# Altium schematic sheet Power_Supply.SchDoc: Power Supply
size A; Author: Yifei Li; DocumentNumber: 1; SheetNumber: 1; SheetTotal: 6
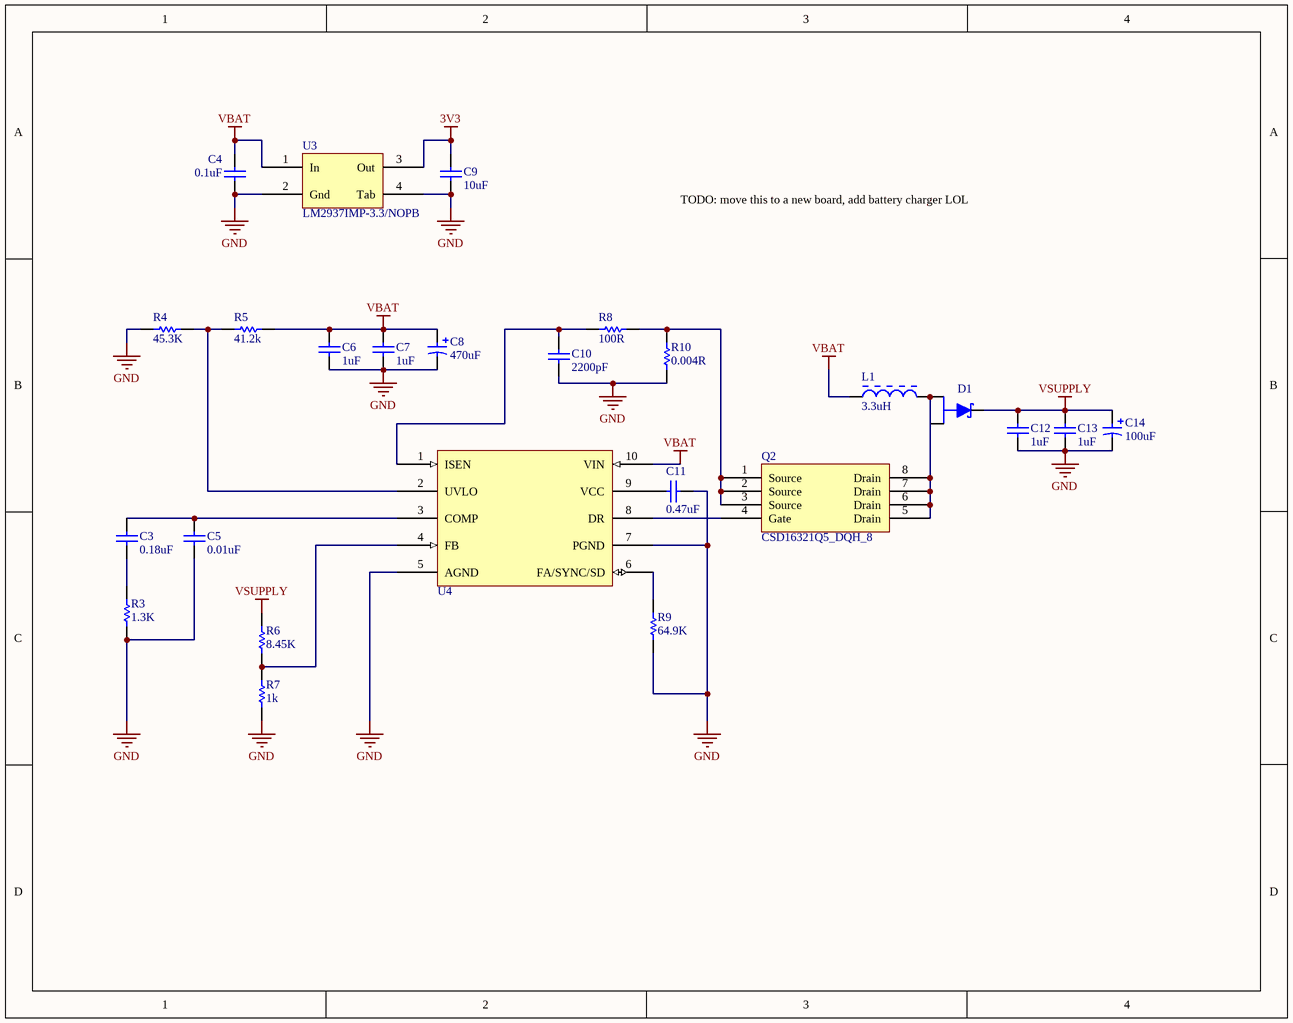
[diagram p0: Power_Supply.SchDoc]

## Parts
C3  0.18uF  [CAPC1608X09N]
C4  0.1uF  [CAPC1608X09N]
C5  0.01uF  [CAPC1608X09N]
C6  1uF  [CAPC1608X09N]
C7  1uF  [CAPC1608X09N]
C8  470uF  [NICHICON 8x10 CAP]
C9  10uF  [CAPC3216X18N]
C10  2200pF  [CAPC1608X09N]
C11  0.47uF  [CAPC1608X09N]
C12  1uF  [CAPC1608X09N]
C13  1uF  [CAPC1608X09N]
C14  100uF  [PCAP_8x10-ELEC00]
D1  (no value)  [ONSEMI DPAK-3]
L1  3.3uH  [IND_BOURNS_SRP00 - duplicate]
Q2  CSD16321Q5_DQH_8  [DQH8]
R3  1.3K  [RESC1608X06N]
R4  45.3K  [RESC1608X06N]
R5  41.2k  [RESC1608X06N]
R6  8.45K  [RESC1608X06N]
R7  1k  [RESC1608X06N]
R8  100R  [RESC1608X06N]
R9  64.9K  [RESC1608X06N]
R10  0.004R  [RESC6533X09N]
U3  LM2937IMP-3.3/NOPB  [DSO-G3/C6.4]
U4  LM3481  [VSSOP10]  (value not drawn)

## Nets
3V3: C9.2 U3.3(Out)
GND: C4.1 C5.1 C6.1 C7.1 C8.2 C9.1 C10.1 C11.2 C12.1 C13.1 C14.2 R3.1 R4.1 R7.1 R9.1 R10.1 U3.2(Gnd) U3.4(Tab) U4.5(AGND) U4.7(PGND)
VBAT: C4.2 C6.2 C7.2 C8.1 L1.1 R5.2 U3.1(In) U4.10(VIN)
VSUPPLY: C12.2 C13.2 C14.1 D1.4 R6.1
NetC3_1: C3.1 R3.2
NetC3_2: C3.2 C5.2 U4.3(COMP)
NetC10_2: C10.2 R8.1 U4.1(ISEN)
NetC11_1: C11.1 U4.9(VCC)
NetD1_1: D1.1 L1.2 Q2.5(Drain) Q2.6(Drain) Q2.7(Drain) Q2.8(Drain)
NetQ2_1: Q2.1(Source) Q2.2(Source) Q2.3(Source) R8.2 R10.2
NetQ2_4: Q2.4(Gate) U4.8(DR)
NetR4_2: R4.2 R5.1 U4.2(UVLO)
NetR6_2: R6.2 R7.2 U4.4(FB)
NetR9_2: R9.2 U4.6(FA/SYNC/SD)

Not connected (* = marked no-connect by the designer): D1 3

## Notes on the sheet
- TODO: move this to a new board, add battery charger LOL

## Library data of the parts
C3 = CAP CER 0.18uF 0603: Manufacturer: Murata; Voltage: 25V; Rating: X7R; Value: 0.18uF; Digikey Part Number: 490-6431-1-ND; Package: 0603
C4 = CAP CER 0.1uF 0603: Voltage: 100V; Rating: X7R; Tolerance: 10%; Value: 0.1uF; Digikey Part Number: 490-3285-1-ND; Package: 0603
C5 = CAP CER 0.01uF 0603: Manufacturer: Murata; Rating: C0G; Value: 0.01uF; Digikey Part Number: 490-9666-1-ND
C6 C7 C12 C13 = CAP CER 1uF 0603: Voltage: 35V; Value: 1uF; Digikey Part Number: 490-10487-1-ND
C8 = CAP ALUM 470uF SMD: Digikey Part Number: 493-2181-1-ND; Value: 470uF
C9 = CAP CER 10uF 1206: 3V3 filter cap; Voltage: 25V; Rating: X7R; Value: 10uF; Digikey Part Number: 490-6518-1-ND
C10 = CAP CER 2200pF 0603: Manufacturer: Murata; Voltage: 50V; Tolerance: 1%; Rating: C0G; Value: 2200pF; Digikey Part Number: 490-7768-1-ND
C11 = CAP CER 0.47uF 0603: Voltage: 25V; Rating: X7R; Value: 0.47uF; Digikey Part Number: 490-3291-1-ND
C14 = CAP ALUM 100uF SMD: Manufacturer: Nichicon; Voltage: 50V; Digikey Part Number: 493-2226-1-ND; Value: 100uF
D1 = MBRD835LT4G: SHOTTKEY 35V 8A; Type: SCHOT; Configuration: Single; Footprint: TO-252-3; Voltage: 35V; Current: 8A; Digikey Part Number: MBRD835LT4GOSCT-ND
L1 = IND 3.3µH 7A SMD: Digikey Part Number: SRP7030-3R3FMCT-ND; Value: 3.3uH
Q2 = CSD16321Q5_DQH_8: Manufacturer: Texas Instruments; INDUSTRY_STD_PKG_TYPE: SON; FAMILY_NAME: N-Channel MOSFET Transistors; PIN_COUNT: 8; PACKAGE_DESIGNATOR: DQH; Type: DEV; Datasheet URL: http://www.ti.com/lit/gpn/CSD16321Q5; GENERIC_PART_NUMBER: CSD16321Q5; RefDes: RefDes; Value: Value; Digikey Part Number: 296-25643-1-ND
R3 = RES 1.3K 0603: Manufacturer: Vishay Dale; Tolerance: 1%; Power: 0.1W; Type: RES; Footprint: 0603; Digikey Part Number: 541-1.30KHCT-ND; Value: 1.3K
R4 = RES 45.3K 0603: Manufacturer: Vishay Dale; Tolerance: 1%; Power: 0.1W; Type: RES; Footprint: 0603; Digikey Part Number: 541-45.3KHCT-ND; Value: 45.3K
R5 = RES 41.2K 0603: Manufacturer: Vishay Dale; Tolerance: 1%; Power: 0.1W; Type: RES; Footprint: 0603; Digikey Part Number: 311-41.2KHRCT-ND; Value: 41.2k
R6 = RES 8.45K 0603: Manufacturer: Vishay Dale; Tolerance: 1%; Power: 0.1W; Type: RES; Footprint: 0603; Digikey Part Number: 541-8.45KHCT-ND; Value: 8.45K
R7 = RES 1K 0603: Manufacturer: Panasonic; Manufacturer Part Number: ERJ-PA3F1001V; Tolerance: 1%; Power: 0.25W; Type: RES; Footprint: 0603; Temperature: 155dC; Digikey Part Number: P1.0KBYCT-ND; Value: 1k
R8 = RES 100R 0603: Tolerance: 1%; Power: 0.25W; Type: RES; Footprint: 0603; Digikey Part Number: 541-100SACT-ND; Value: 100R
R9 = RES 64.9K 0603: Manufacturer: Vishay Dale; Tolerance: 1%; Power: 0.1W; Type: RES; Footprint: 0603; Digikey Part Number: 541-64.9KHCT-ND; Value: 64.9K
R10 = RES 0.004R 2512: Manufacturer: Panasonic; Tolerance: 1%; Power: 1W; Type: RES; Footprint: 2512; Digikey Part Number: P4.0MCT-ND; Value: 0.004R
U4 = LM3481: IC REG CTRLR MULT TOP 10MSOP; Digikey Part Number: LM3481MM/NOPBCT-ND
U3 = LM2937IMP-3.3/NOPB: Digikey Part Number: LM2937IMP-3.3/NOPBCT-ND